# EAGLE design SOS-Water-Ingress-Sensor (EAGLE 7.6.0)
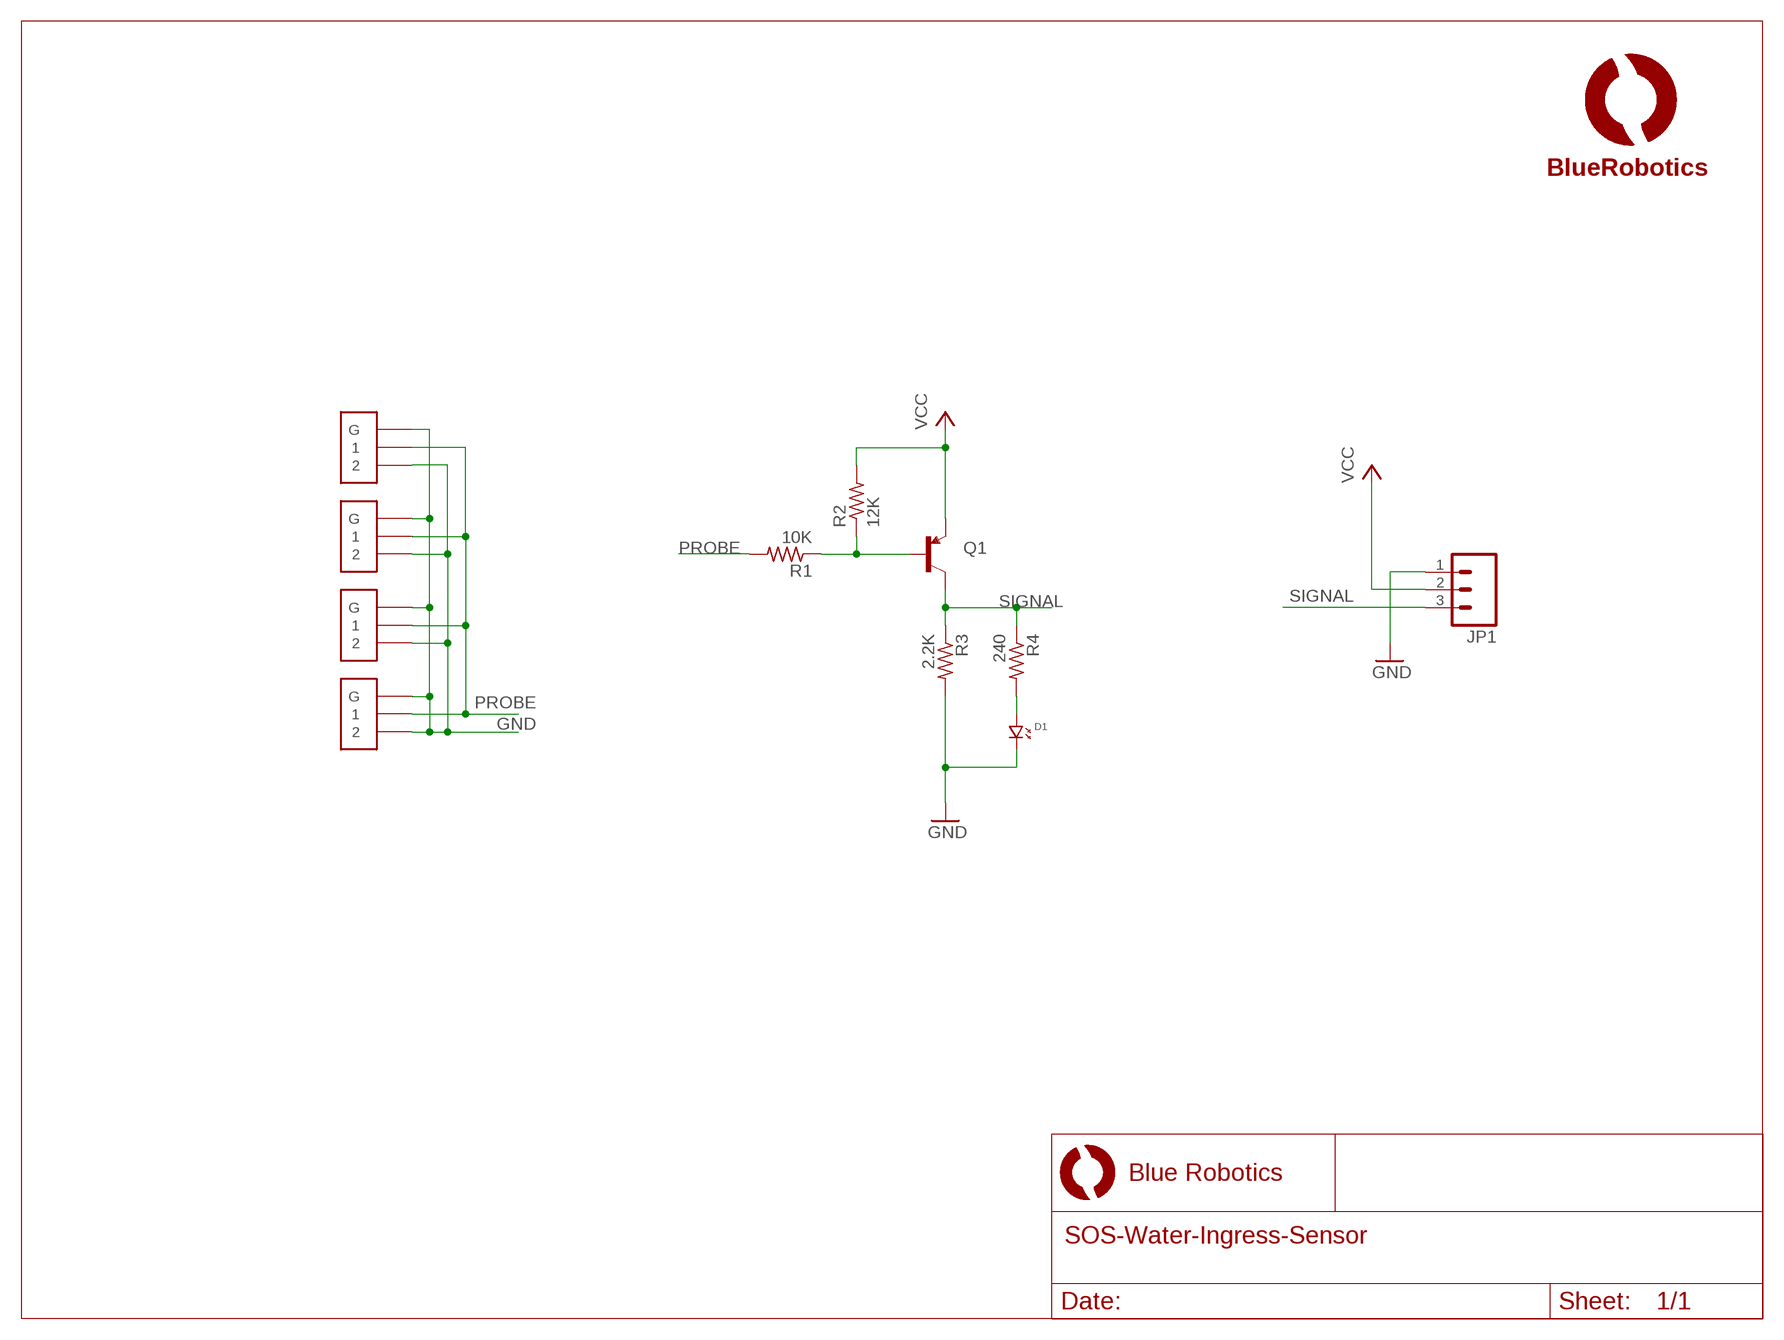
[diagram p0: schematic, sheet 1]

## Parts
D1  LED.0805  [0805.LED]
JP1  M03PTH  [1X03]
Q1  TRANSISTOR_PNPSMD  [SOT23-3]
R1  10K  R-US_R0603  [R0603]
R2  12K  R-US_R0603  [R0603]
R3  2.2K  R-US_R0603  [R0603]
R4  240  R-US_R0603  [R0603]
U$1  JSH-GH-2VERT  [JST-GH-TOP-2]
U$2  JSH-GH-2VERT  [JST-GH-TOP-2]
U$3  JSH-GH-2VERT  [JST-GH-TOP-2]
U$4  JSH-GH-2VERT  [JST-GH-TOP-2]
U$7  LOGOBR-LOGO-S  [BR-LOGO-SMALL]

## Nets
GND: D1.P$2 JP1.1 R3.2 U$1.2 U$1.MECH1(G) U$1.MECH2(G) U$2.2 U$2.MECH1(G) U$2.MECH2(G) U$3.2 U$3.MECH1(G) U$3.MECH2(G) U$4.2 U$4.MECH1(G) U$4.MECH2(G)
N$1: Q1.1(B) R1.1 R2.1
N$2: D1.P$1 R4.2
PROBE: R1.2 U$1.1 U$2.1 U$3.1 U$4.1
SIGNAL: JP1.3 Q1.3(C) R3.1 R4.1
VCC: JP1.2 Q1.2(E) R2.2

## Library data of the parts
D1 = standardparts:LED
JP1 = SparkFun-Connectors:M03: Header 3 Standard 3-pin 0.1" header. Use with straight break away headers (SKU : PRT-00116), right angle break away headers (PRT-00553), swiss pins (PRT-00743), machine pins (PRT-00117), and female headers (PRT-00115). Molex polarized connector foot print use with SKU : PRT-08232 with associated crimp pins and housings.
Q1 = SparkFun-DiscreteSemi:TRANSISTOR_PNP: Generic PNP BJT Double check pinouts against datasheets- not all devices are the same! MMBT3906 - 40V 200mA SOT-23 (TRANS-08052) MMBT4403 - 40V 600mA SOT-23 (TRANS-09245)
R1-R4 = resistor:R-US_: RESISTOR, American symbol
U$1-U$4 = BlueRobotics-JST-GH:JSH-GH-2
U$7 = BR-Eagle-Library:LOGO

## Board
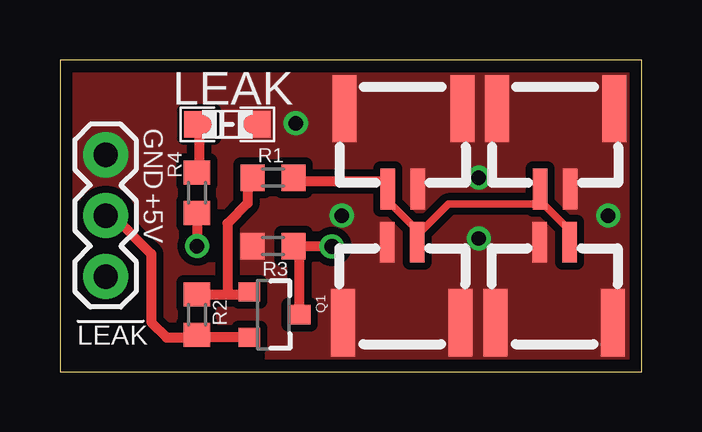
[diagram p1: board, top side]
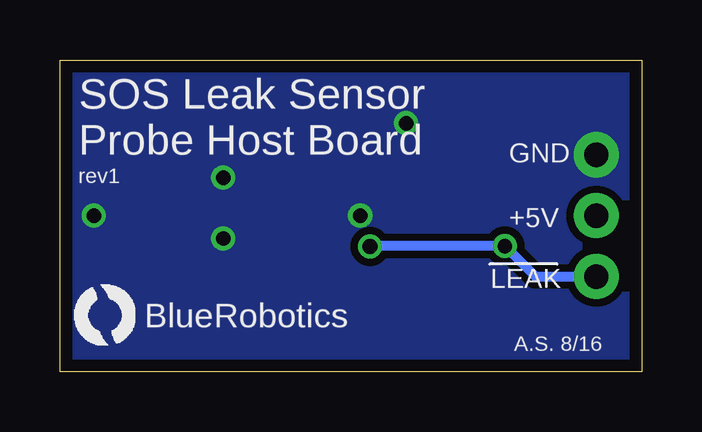
[diagram p2: board, bottom side, seen from below]

Size 24.27 x 13 mm. Coordinates in mm from the lower left corner, seen from the top.
Outline: 0,0 24.27,0 24.27,13 0,13 0,0
Copper layers (1*16): Top 0.035mm / dielectric 1.5mm / Bottom 0.035mm
Design rules "default *": minimum track width 10mil, minimum drill 16mil, track to track 8mil, track to pad 8mil, pad to pad 8mil, via to via 8mil, smd to smd 8mil, copper to edge 20mil, drill to drill 8mil, minimum pad ring 10mil, minimum via ring 8mil, stop-mask expansion 4mil, vias tented up to drill 30mil, thermal gap 10mil

### Footprints (pad centres in the part's own frame; a part is rotated, then mirrored left to right if it is on the bottom)
0805.LED = smd 1.25 x 1.1: P$1 -1.175,0; P$2 1.175,0
1X03 = drill 1.016 pad 1.88: 1 0,0; 2 2.54,0; 3 5.08,0
SOT23-3 = smd 0.8 x 0.9: 1 -0.95,-1; 2 0.95,-1; 3 0,1.1
R0603 = smd 1 x 1.1: 1 -0.85,0; 2 0.85,0
JST-GH-TOP-2 = smd 0.6 x 1.7: 1 1.25,0; 2 0,0 | smd 1 x 2.8: MECH1 3.05,-3.35; MECH2 -1.85,-3.35

### Placement (x,y rotation side)
D1  6.99,10.32 0 top
JP1  1.91,9.05 270 top
Q1  8.89,2.38 270 top
R1  8.89,8.1 0 top
R2  5.71,2.38 270 top
R3  8.89,5.24 180 top
R4  5.71,7.46 90 top
U$1  13.65,5.4 0 top
U$2  20,5.4 0 top
U$3  14.92,7.62 180 top
U$4  21.27,7.62 180 top
U$7  23.65,1.11 0 bottom

### Tracks (layer width: path | path; a pad name or v marks a point on that pad's centre or on a via)
GND  (via drill 0.6)
  other vias: 9.83,10.37 11.75,6.51 17.46,8.1 17.46,5.56 22.86,6.51
  pour Bottom (isolate 0.305, no thermals): -1.91,14.13 26.04,14.13 26.04,-1.11 -1.91,-1.11
  pour Top (isolate 0.305, no thermals): -4.45,14.13 -4.45,-1.11 26.04,-1.11 26.04,14.13
N$1
  Top 0.406: R1.1 7.82,7.93 7.82,7.03 6.99,6.19 6.99,3.23 | R2.1 6.99,3.23 | 6.99,3.23 7.79,3.23 Q1.1
N$2
  Top 0.406: D1.P$1 5.81,8.41 R4.2
PROBE
  Top 0.254: 21.08,5.87 21.08,5.42 U$2.1 | 20.01,7.7 U$4.1 | 13.54,7.93 U$3.1 13.77,7.7 13.77,7.25
  Top 0.305: 13.77,7.25 13.77,7.03 14.92,5.87 | 14.92,5.87 14.92,5.26 U$1.1 | 14.92,5.87 15.08,5.87 16.19,6.98 20.16,6.98 | 20.16,6.98 21.25,5.89 U$2.1 | U$4.1 20.16,7.48 20.16,6.98
  Top 0.406: 13.54,7.93 9.88,7.93 R1.2
SIGNAL  (via drill 0.6, 0.61)
  Top 0.254: 9.88,5.19 R3.1
  Top 0.406: R4.1 v5.71,5.24 | Q1.3 9.99,4.99 R3.1 9.75,5.23 v11.34,5.23
  Bottom 0.406: JP1.3 4.45,3.97 v5.71,5.24 11.33,5.24 v11.34,5.23
VCC
  Top 0.406: Q1.2 5.82,1.43 R2.2 5.61,1.43 4.45,1.43 3.81,2.06 3.81,4.92 2.22,6.51 JP1.2

### Text on the board
tPlace: LEAK
bPlace: LEAK | BlueRobotics
tNames: LEAK | GND | +5V
bNames: GND | SOS Leak Sensor / Probe Host Board | rev1 | +5V | A.S. 8/16